# EAGLE design Schematic_Voltage_Monitoring_2 (EAGLE 9.6.2)
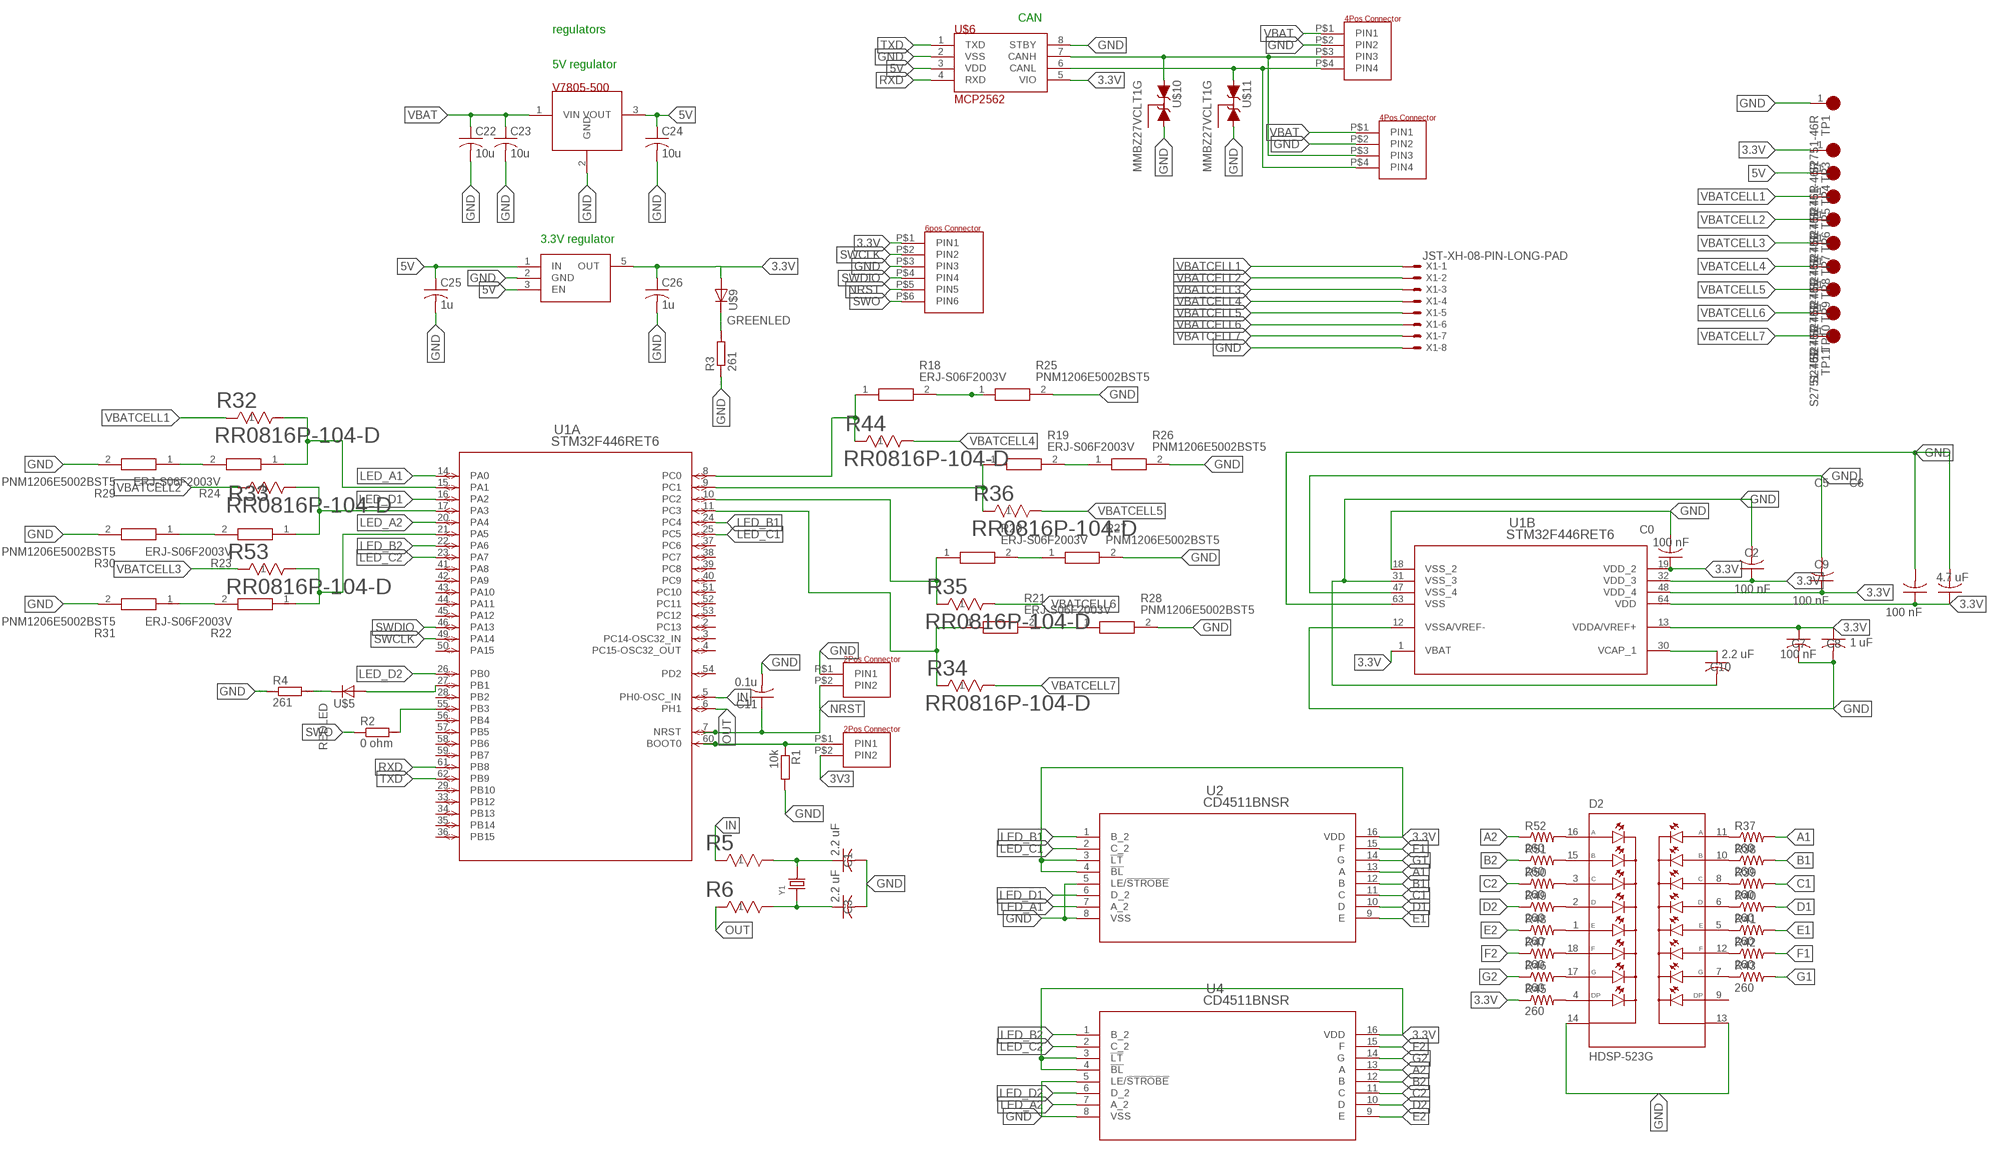
[diagram p0: schematic, sheet 1]

## Parts
C0  100 nF  C-USC0603  [C0603]
C1  2.2 uF  C-USC0603  [C0603]
C2  100 nF  C-USC0603  [C0603]
C3  2.2 uF  C-USC0603  [C0603]
C5  100 nF  C-USC0603  [C0603]
C6  4.7 uF  C-USC0603  [C0603]
C7  100 nF  C-USC0603  [C0603]
C8  1 uF  C-USC0603  [C0603]
C9  100 nF  C-USC0603  [C0603]
C10  2.2 uF  C-USC0603  [C0603]
C11  0.1u  C-USC1206K  [C1206K]
C22  10u  C-USC1206K  [C1206K]
C23  10u  C-USC1206K  [C1206K]
C24  10u  C-USC1206K  [C1206K]
C25  1u  C-USC1206K  [C1206K]
C26  1u  C-USC1206K  [C1206K]
D2  HDSP-523G  [LED_HDSP-523G]
R1  10k  R-EU_R0603  [R0603]
R2  0 ohm  R-EU_R0603  [R0603]
R3  261  RR0603  [R0603]
R4  261  RR0603  [R0603]
R5  RR0816P-104-D  [RES_0816_SUS]
R6  RR0816P-104-D  [RES_0816_SUS]
R18  ERJ-S06F2003V  [ERJS06_U06_(0805)]
R19  ERJ-S06F2003V  [ERJS06_U06_(0805)]
R20  ERJ-S06F2003V  [ERJS06_U06_(0805)]
R21  ERJ-S06F2003V  [ERJS06_U06_(0805)]
R22  ERJ-S06F2003V  [ERJS06_U06_(0805)]
R23  ERJ-S06F2003V  [ERJS06_U06_(0805)]
R24  ERJ-S06F2003V  [ERJS06_U06_(0805)]
R25  PNM1206E5002BST5  [RESC3216X71N]
R26  PNM1206E5002BST5  [RESC3216X71N]
R27  PNM1206E5002BST5  [RESC3216X71N]
R28  PNM1206E5002BST5  [RESC3216X71N]
R29  PNM1206E5002BST5  [RESC3216X71N]
R30  PNM1206E5002BST5  [RESC3216X71N]
R31  PNM1206E5002BST5  [RESC3216X71N]
R32  RR0816P-104-D  [RES_0816_SUS]
R33  RR0816P-104-D  [RES_0816_SUS]
R34  RR0816P-104-D  [RES_0816_SUS]
R35  RR0816P-104-D  [RES_0816_SUS]
R36  RR0816P-104-D  [RES_0816_SUS]
R37  260  R-US_R0603  [R0603]
R38  260  R-US_R0603  [R0603]
R39  260  R-US_R0603  [R0603]
R40  260  R-US_R0603  [R0603]
R41  260  R-US_R0603  [R0603]
R42  260  R-US_R0603  [R0603]
R43  260  R-US_R0603  [R0603]
R44  RR0816P-104-D  [RES_0816_SUS]
R45  260  R-US_R0603  [R0603]
R46  260  R-US_R0603  [R0603]
R47  260  R-US_R0603  [R0603]
R48  260  R-US_R0603  [R0603]
R49  260  R-US_R0603  [R0603]
R50  260  R-US_R0603  [R0603]
R51  260  R-US_R0603  [R0603]
R52  260  R-US_R0603  [R0603]
R53  RR0816P-104-D  [RES_0816_SUS]
TP1  S2751-46R  [HARWIN_S2751-46R]
TP3  S2751-46R  [HARWIN_S2751-46R]
TP4  S2751-46R  [HARWIN_S2751-46R]
TP5  S2751-46R  [HARWIN_S2751-46R]
TP6  S2751-46R  [HARWIN_S2751-46R]
TP7  S2751-46R  [HARWIN_S2751-46R]
TP8  S2751-46R  [HARWIN_S2751-46R]
TP9  S2751-46R  [HARWIN_S2751-46R]
TP10  S2751-46R  [HARWIN_S2751-46R]
TP11  S2751-46R  [HARWIN_S2751-46R]
U1  STM32F446RET6  [LQFP64-10X10MM]
U2  CD4511BNSR  [NS16]
U4  CD4511BNSR  [NS16]
U$1  4POS_CONNECTORMOLEX_MICROFIT3.0_RA_4PIN_2ROW  [MOLEX_MICROFIT3.0_0430450400]
U$2  4POS_CONNECTORMOLEX_MICROFIT3.0_RA_4PIN_2ROW  [MOLEX_MICROFIT3.0_0430450400]
U$3  6POS_CONNECTOR.1"PITCH_HEADERS  [6POS_HEADER_.1"]
U$4  2POS_CONNECTOR,.1"HEADER  [2POS_HEADER_.1"]
U$5  LED06033D_0603  [LEDC1608X35]
U$6  MCP2562  [SOIC8]
U$7  2POS_CONNECTOR,.1"HEADER  [2POS_HEADER_.1"]
U$8  V7805-500  [SIP3]
U$9  LED06033D_0603  [LEDC1608X35]
U$10  MMBZ27VCLT1G  [SOT23]
U$11  MMBZ27VCLT1G  [SOT23]
U$23  TLV70233DBVR  [SOT-23-5]
X1  JST-XH-08-PIN-LONG-PAD  [JST-XH-08-PACKAGE-LONG-PAD]
Y1  DIP-CRYSTAL-16MHZ-18PF-30PPM-40R(HC49US)  [HC49US]

## Nets
3.3V: C0.1 C2.1 C5.1 C6.1 C7.1 C8.1 C9.1 C26.1 R45.1 TP3.1(TP) U1.1(B:VBAT) U1.13(B:VDDA/VREF+) U1.19(B:VDD_2) U1.32(B:VDD_3) U1.48(B:VDD_4) U1.64(B:VDD) U2.3(!LT) U2.4(!BL) U2.16(VDD) U4.3(!LT) U4.4(!BL) U4.16(VDD) U$3.P$1(PIN1) U$6.5(VIO) U$9.A U$23.5(OUT)
3V3: U$7.P$2(PIN2)
5V: C24.1 C25.1 TP4.1(TP) U$6.3(VDD) U$8.3(VOUT) U$23.1(IN) U$23.3(EN)
A1 [New Class]: R37.2 U2.13(A)
A2 [New Class]: R52.1 U4.13(A)
B1 [New Class]: R38.2 U2.12(B)
B2 [New Class]: R51.1 U4.12(B)
C1 [New Class]: R39.2 U2.11(C)
C2 [New Class]: R50.1 U4.11(C)
CANH: U$1.P$3(PIN3) U$2.P$3(PIN3) U$6.7(CANH) U$10.1(A1)
CANL: U$1.P$4(PIN4) U$2.P$4(PIN4) U$6.6(CANL) U$11.1(A1)
D1 [New Class]: R40.2 U2.10(D)
D2 [New Class]: R49.1 U4.10(D)
E1 [New Class]: R41.2 U2.9(E)
E2 [New Class]: R48.1 U4.9(E)
F1 [New Class]: R42.2 U2.15(F)
F2 [New Class]: R47.1 U4.15(F)
G1 [New Class]: R43.2 U2.14(G)
G2 [New Class]: R46.1 U4.14(G)
GND: C0.2 C1.2 C2.2 C3.2 C5.2 C6.2 C7.2 C8.2 C9.2 C10.2 C11.2 C22.2 C23.2 C24.2 C25.2 C26.2 D2.13(COM2) D2.14(COM1) R1.2 R3.1 R4.1 R25.2 R26.2 R27.2 R28.2 R29.2 R30.2 R31.2 TP1.1(TP) U1.12(B:VSSA/VREF-) U1.18(B:VSS_2) U1.31(B:VSS_3) U1.47(B:VSS_4) U1.63(B:VSS) U2.5(LE/!STROBE) U2.8(VSS) U4.5(LE/!STROBE) U4.8(VSS) U$1.P$2(PIN2) U$2.P$2(PIN2) U$3.P$3(PIN3) U$4.P$1(PIN1) U$6.2(VSS) U$6.8(STBY) U$8.2(GND) U$10.2(A2) U$11.2(A2) U$23.2(GND) X1.8
GREENLED: R3.2 U$9.C
IN: R5.1 U1.5(A:PH0-OSC_IN)
LED_A1: U1.14(A:PA0) U2.7(A_2)
LED_A2: U1.20(A:PA4) U4.7(A_2)
LED_B1: U1.24(A:PC4) U2.1(B_2)
LED_B2: U1.22(A:PA6) U4.1(B_2)
LED_C1: U1.25(A:PC5) U2.2(C_2)
LED_C2: U1.23(A:PA7) U4.2(C_2)
LED_D1: U1.16(A:PA2) U2.6(D_2)
LED_D2: U1.26(A:PB0) U4.6(D_2)
N$1: C10.1 U1.30(B:VCAP_1)
N$2: R1.1 U1.60(A:BOOT0) U$7.P$1(PIN1)
N$3: R2.2 U1.55(A:PB3)
N$4: R19.1 R36.1 U1.9(A:PC1)
N$5: U1.27(A:PB1) U$5.A
N$6: C1.1 R5.2 Y1.2
N$7: C3.1 R6.2 Y1.1
N$14 [New Class]: D2.11(A2) R37.1
N$16 [New Class]: D2.10(B2) R38.1
N$17 [New Class]: D2.8(C2) R39.1
N$18 [New Class]: D2.6(D2) R40.1
N$19 [New Class]: D2.5(E2) R41.1
N$20 [New Class]: D2.12(F2) R42.1
N$21 [New Class]: D2.7(G2) R43.1
N$23 [New Class]: D2.4(DP1) R45.2
N$24 [New Class]: D2.17(G1) R46.2
N$25 [New Class]: D2.18(F1) R47.2
N$26 [New Class]: D2.1(E1) R48.2
N$27 [New Class]: D2.2(D1) R49.2
N$28 [New Class]: D2.3(C1) R50.2
N$29 [New Class]: D2.15(B1) R51.2
N$30 [New Class]: D2.16(A1) R52.2
N$34: R18.1 R44.1 U1.8(A:PC0)
N$36: R20.1 R35.1 U1.10(A:PC2)
N$37: R21.1 R34.1 U1.11(A:PC3)
N$38: R24.1 R32.2 U1.15(A:PA1)
N$39: R22.1 R53.2 U1.21(A:PA5)
N$40: R18.2 R25.1
N$41: R23.1 R33.2 U1.17(A:PA3)
N$42: R19.2 R26.1
N$43: R20.2 R27.1
N$44: R21.2 R28.1
N$45: R24.2 R29.1
N$46: R23.2 R30.1
N$47: R22.2 R31.1
NRST: C11.1 U1.7(A:NRST) U$3.P$5(PIN5) U$4.P$2(PIN2)
OUT: R6.1 U1.6(A:PH1)
REDLED: R4.2 U$5.C
RXD: U1.61(A:PB8) U$6.4(RXD)
SWCLK: U1.49(A:PA14) U$3.P$2(PIN2)
SWDIO: U1.46(A:PA13) U$3.P$4(PIN4)
SWO: R2.1 U$3.P$6(PIN6)
TXD: U1.62(A:PB9) U$6.1(TXD)
VBAT: C22.1 C23.1 U$1.P$1(PIN1) U$2.P$1(PIN1) U$8.1(VIN)
VBATCELL1: R32.1 TP5.1(TP) X1.1
VBATCELL2: R33.1 TP6.1(TP) X1.2
VBATCELL3: R53.1 TP7.1(TP) X1.3
VBATCELL4: R44.2 TP8.1(TP) X1.4
VBATCELL5: R36.2 TP9.1(TP) X1.5
VBATCELL6: R35.2 TP10.1(TP) X1.6
VBATCELL7: R34.2 TP11.1(TP) X1.7
Unconnected: D2.9(DP2) U1.2(A:PC13) U1.3(A:PC14-OSC32_IN) U1.4(A:PC15-OSC32_OUT) U1.28(A:PB2) U1.29(A:PB10) U1.33(A:PB12) U1.34(A:PB13) U1.35(A:PB14) U1.36(A:PB15) U1.37(A:PC6) U1.38(A:PC7) U1.39(A:PC8) U1.40(A:PC9) U1.41(A:PA8) U1.42(A:PA9) U1.43(A:PA10) U1.44(A:PA11) U1.45(A:PA12) U1.50(A:PA15) U1.51(A:PC10) U1.52(A:PC11) U1.53(A:PC12) U1.54(A:PD2) U1.56(A:PB4) U1.57(A:PB5) U1.58(A:PB6) U1.59(A:PB7) U$10.3(C) U$11.3(C)

## Notes on the sheet
- CAN
- regulators
- 5V regulator
- 3.3V regulator

## Library data of the parts
C0 C1-C3 C5-C11 C22-C26 = rcl:C-US: CAPACITOR, American symbol; SPICEPREFIX: C
D2 = HDSP-523G:HDSP-523G: Display Modules - LED Character and Numeric Green 7-Segment 2 Character Common Cathode 2V 10mA 0.732in H x 0.984in W x 0.315in D (18.60mm x 25.00mm x 8.00mm) 18-DIP (0.600", 15.24mm) Check availability <https://pricing.snapeda.com/parts/HDSP-523G/Broadcom%20Limited/view-part?ref=eda>; AVAILABILITY: In Stock; DESCRIPTION: Display Modules - LED Character and Numeric Green 7-Segment 2 Character Common Cathode 2V 10mA 0.732 H x 0.984 W x 0.315 D (18.60mm x 25.00mm x 8.00mm) 18-DIP (0.600, 15.24mm); MF: Broadcom Limited; MP: HDSP-523G; PACKAGE: None; PRICE: None; PURCHASE-URL: https://pricing.snapeda.com/search/part/HDSP-523G/?ref=eda
R1 R2 = rcl:R-EU_: RESISTOR, European symbol; SPICEPREFIX: R
R3 R4 = eagle-ltspice:R: RESISTOR, European symbol; SPICEMODEL: NONE; SPICEPREFIX: R
R5 R6 R32-R36 R44 R53 = RES_0816_SUS-L:RR0816P-104-D; COPYRIGHT: Copyright (C) 2022 Ultra Librarian. All rights reserved.; DIGI-KEY_PART_NUMBER_1: RR08P100KDCT-ND; DIGI-KEY_PART_NUMBER_2: RR08P100KDDKR-ND; DIGI-KEY_PART_NUMBER_3: RR08P100KDTR-ND; DIGI-KEY_PART_NUMBER_4: RR08P100KDTR-NDL; MANUFACTURER_PART_NUMBER: RR0816P-104-D; MFR_NAME: Susumu
R18-R24 = ERJ-S06F2003V:ERJ-S06F2003V: Anti-Sulfurated Thick Film Chip Resistor, 0805, 0.125W Source: Datasheet <https://industrial.panasonic.com/cdbs/www-data/pdf/RDP0000/AOA0000C334.pdf>; DESCRIPTION: Anti-Sulfurated Thick Film Chip Resistor, 0805, 0.125W; HEIGHT: 0.7mm; MANUFACTURER_NAME: Panasonic; MANUFACTURER_PART_NUMBER: ERJ-S06F2003V; MOUSER_PART_NUMBER: 667-ERJ-S06F2003V; MOUSER_PRICE-STOCK: https://www.mouser.co.uk/ProductDetail/Panasonic/ERJ-S06F2003V?qs=Zyl8A9hlmJrPJBwR8QJJlg%3D%3D
R25-R31 = PNM1206E5002BST5:PNM1206E5002BST5: RESISTOR, 1206 50K Ohms +/- 0.1 % 400mW Source: Datasheet <https://www.mouser.com/datasheet/2/427/pnm-247439.pdf>; DESCRIPTION: RESISTOR, 1206 50K Ohms +/- 0.1 % 400mW; HEIGHT: mm; MANUFACTURER_NAME: Vishay; MANUFACTURER_PART_NUMBER: PNM1206E5002BST5; MOUSER_PART_NUMBER: 71-PNM1206E5002BST5
R37-R43 R45-R52 = rcl:R-US_: RESISTOR, American symbol; SPICEPREFIX: R
TP1 TP3-TP11 = CMR:S2751-46R: EZ-Test Point, SMT, tin, Tape and Reeled Check prices <https://pricing.snapeda.com/parts/S2751-46R/Harwin%20Inc./view-part?ref=eda>; AVAILABILITY: In Stock; DESCRIPTION: Natural PC Test Point Brass, Tin Plating Surface Mount Mounting Type; MF: Harwin Inc.; MP: S2751-46R; PACKAGE: None; PRICE: None; PURCHASE-URL: https://pricing.snapeda.com/search/part/S2751-46R/?ref=eda
U1 = CMR:STM32F446RET6; COPYRIGHT: Copyright (C) 2022 Ultra Librarian. All rights reserved.; MANUFACTURER_PART_NUMBER: STM32F446RET6; MFR_NAME: STMicroelectronics
U2 U4 = CMR:CD4511BNSR; COPYRIGHT: Copyright (C) 2022 Ultra Librarian. All rights reserved.; MANUFACTURER_PART_NUMBER: CD4511BNSR; MFR_NAME: Texas Instruments
U$1 U$2 = CMR:4POS_CONNECTOR: 4 position connector could be header or connector
U$3 = CMR:6POS_CONNECTOR: An arbitray 6 position connector. packages should denote pin 1 using a square pad
U$4 U$7 = CMR:2POS_CONNECTOR: Harwin 2mm 2 POS Connector Male - https://www.digikey.com/product-detail/en/harwin-inc/M80-8520242/952-1769-ND/3727738 Female - https://www.digikey.com/product-detail/en/harwin-inc/M80-8980205/952-1182-ND/2264171
U$5 U$9 = CMR:LED0603: LED size 0603 for debugging pic
U$6 = CMR:MCP2562: CAN Transciever with built in level shifter
U$8 = CMR:V7805-500: Switching regulator (24V to 5V); max output current: 500mA; SPICEPREFIX: U
U$10 U$11 = CMR:MMBZ27VCLT1G: MMBZ27VCLT1G TVS Diode for protecting against ESD events link: https://www.digikey.com/product-detail/en/on-semiconductor/MMBZ27VCLT1G/MMBZ27VCLT1GOSCT-ND/964555
U$23 = CMR:TLV70233DBVR: TLV702 300-mA, Low-IQ, Low-Dropout Regulator
X1 = Rembrandt Electronics - JST XH Connectors v1-0:JST-XH-08-PIN: JST XH Connector 2 Pin Wire to board connector. Pitch: 2,54 mm, (0.100") Number of pins: 8 Created by Rembrandt Electronics www.rembrandtelectronics.com
Y1 = DIP-CRYSTAL-16MHZ-18PF-30PPM-40R_HC49US_:DIP-CRYSTAL-16MHZ-18PF-30PPM-40R(HC49US): 306010014 Check availability <https://pricing.snapeda.com/parts/HC49US16000MHZ/Kyocera/view-part?ref=eda>; AVAILABILITY: Not in stock; MF: Kyocera; MP: HC49US16000MHZ; PACKAGE: None; PRICE: None

## Board
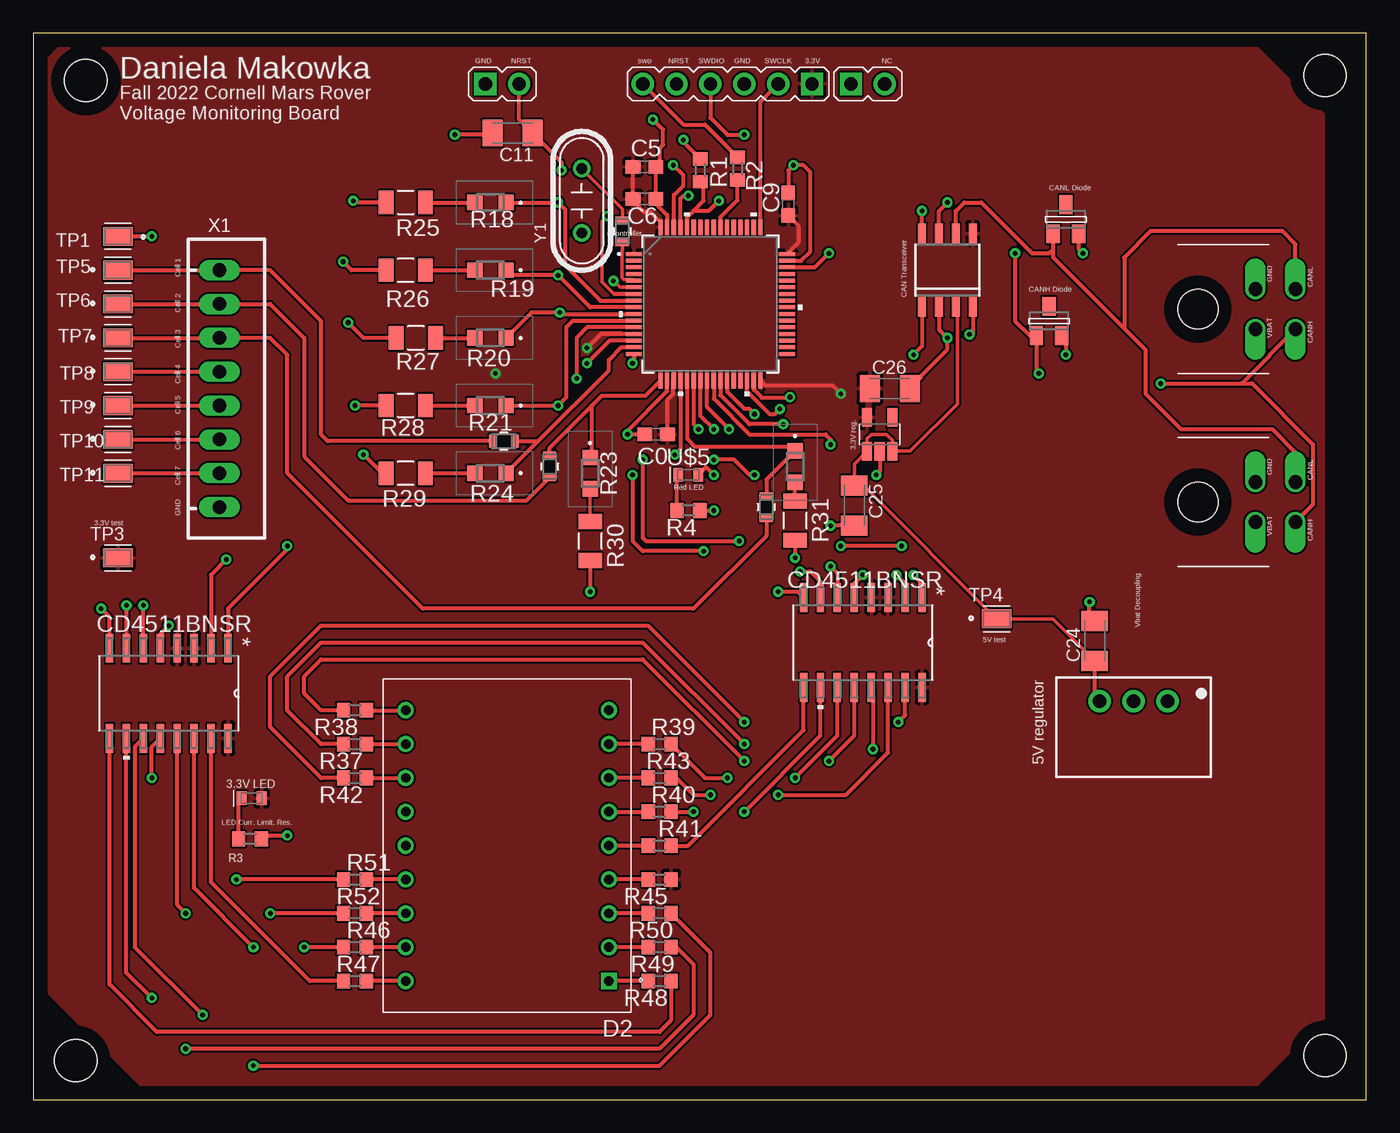
[diagram p1: board, top side]
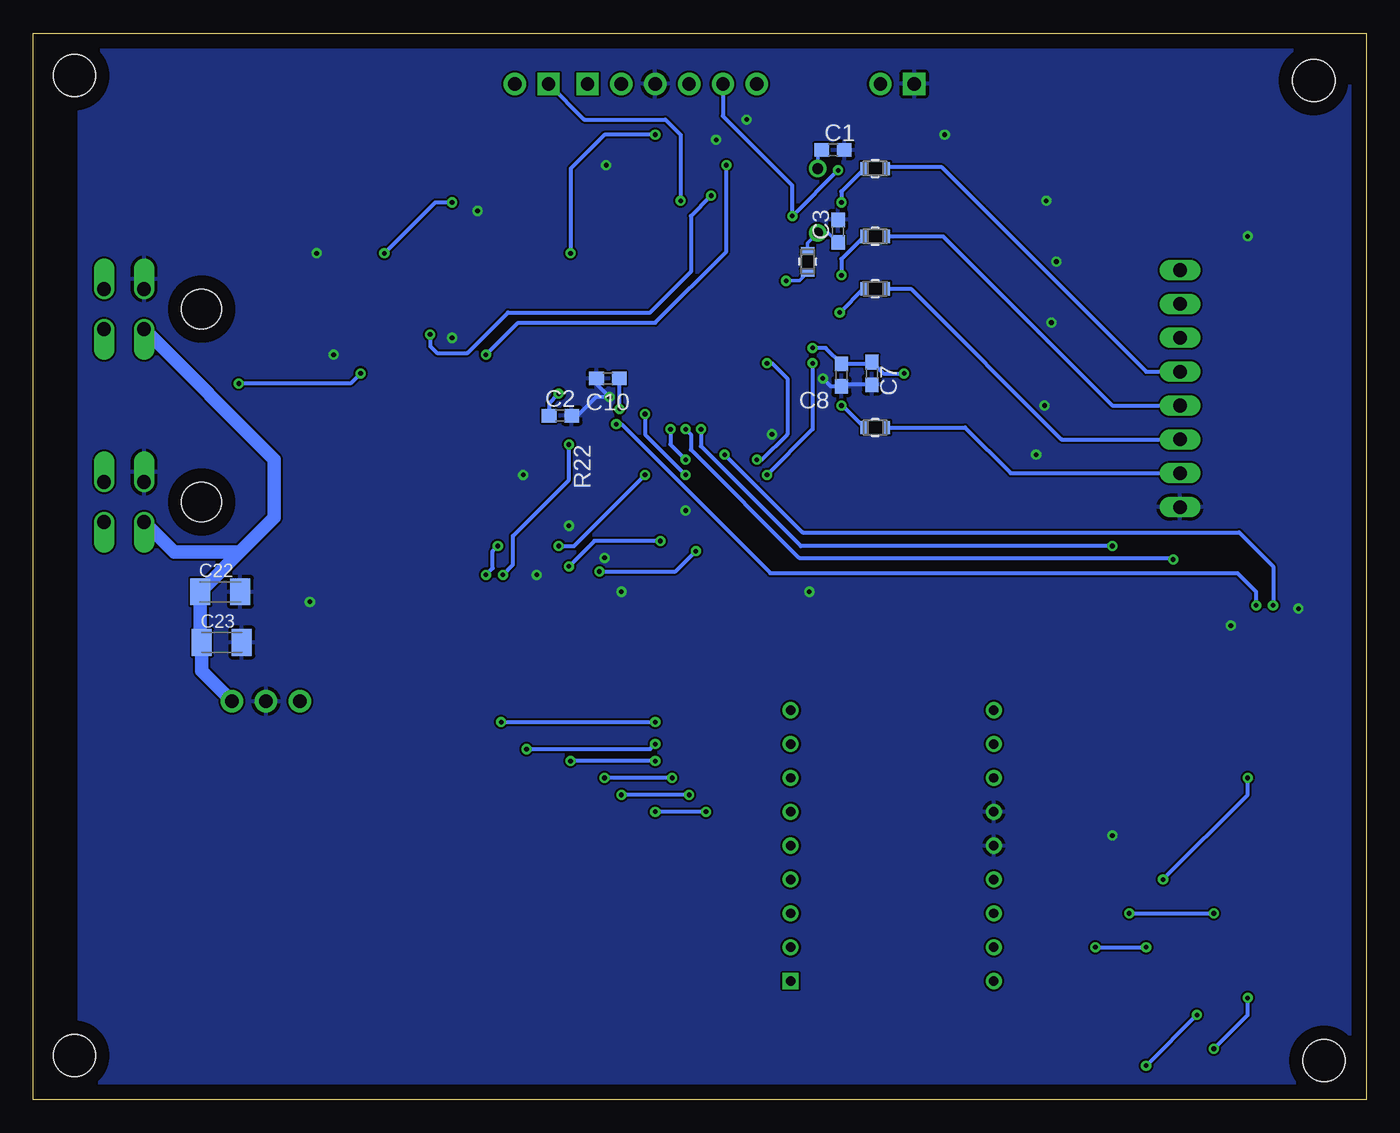
[diagram p2: board, bottom side, seen from below]

Size 100 x 80 mm. Coordinates in mm from the lower left corner, seen from the top.
Outline: 0,0 100,0 100,80 0,80 0,0
Copper layers (1*16): Top 0.035mm / dielectric 1.5mm / Bottom 0.035mm
Design rules "default": minimum track width 6mil, minimum drill 0.35mm, track to track 6mil, track to pad 6mil, pad to pad 6mil, via to via 6mil, smd to smd 6mil, copper to edge 40mil, drill to drill 6mil, minimum pad ring 10mil, minimum via ring 8mil, stop-mask expansion 4mil, vias tented up to drill 0mil, thermal gap 10mil
Holes 3.17 mm at 3.94,76.45 96.9,76.83 3.17,2.92 96.9,3.3

### Footprints (pad centres in the part's own frame; a part is rotated, then mirrored left to right if it is on the bottom)
C0603 = smd 1.1 x 1: 1 -0.85,0; 2 0.85,0
C1206K = smd 1.5 x 2: 1 -1.5,0; 2 1.5,0
LED_HDSP-523G = drill 0.7 square: 1 -7.62,10.16 | drill 0.7: 2 -7.62,7.62; 3 -7.62,5.08; 4 -7.62,2.54; 5 -7.62,0; 6 -7.62,-2.54; 7 -7.62,-5.08; 8 -7.62,-7.62; 9 -7.62,-10.16; 10 7.62,-10.16; 11 7.62,-7.62; 12 7.62,-5.08; 13 7.62,-2.54; 14 7.62,0; 15 7.62,2.54; 16 7.62,5.08; 17 7.62,7.62; 18 7.62,10.16
R0603 = smd 1 x 1.1: 1 -0.85,0; 2 0.85,0
RES_0816_SUS = smd 0.553 x 1: 1 -0.827,0; 2 0.827,0
ERJS06_U06_(0805) = smd 1.15 x 1.15: 1 -1.175,0; 2 1.175,0
RESC3216X71N = smd 1.118 x 1.753: 1 -1.473,0; 2 1.473,0
HARWIN_S2751-46R = smd 2.2 x 1.4: 1 0,0
LQFP64-10X10MM = smd 1.194 x 0.305: 1 -5.75,3.75; 2 -5.75,3.25; 3 -5.75,2.75; 4 -5.75,2.25; 5 -5.75,1.75; 6 -5.75,1.25; 7 -5.75,0.75; 8 -5.75,0.25; 9 -5.75,-0.25; 10 -5.75,-0.75; 11 -5.75,-1.25; 12 -5.75,-1.75; 13 -5.75,-2.25; 14 -5.75,-2.75; 15 -5.75,-3.25; 16 -5.75,-3.75; 33 5.75,-3.75; 34 5.75,-3.25; 35 5.75,-2.75; 36 5.75,-2.25; 37 5.75,-1.75; 38 5.75,-1.25; 39 5.75,-0.75; 40 5.75,-0.25; 41 5.75,0.25; 42 5.75,0.75; 43 5.75,1.25; 44 5.75,1.75; 45 5.75,2.25; 46 5.75,2.75; 47 5.75,3.25; 48 5.75,3.75 | smd 0.305 x 1.194: 17 -3.75,-5.75; 18 -3.25,-5.75; 19 -2.75,-5.75; 20 -2.25,-5.75; 21 -1.75,-5.75; 22 -1.25,-5.75; 23 -0.75,-5.75; 24 -0.25,-5.75; 25 0.25,-5.75; 26 0.75,-5.75; 27 1.25,-5.75; 28 1.75,-5.75; 29 2.25,-5.75; 30 2.75,-5.75; 31 3.25,-5.75; 32 3.75,-5.75; 49 3.75,5.75; 50 3.25,5.75; 51 2.75,5.75; 52 2.25,5.75; 53 1.75,5.75; 54 1.25,5.75; 55 0.75,5.75; 56 0.25,5.75; 57 -0.25,5.75; 58 -0.75,5.75; 59 -1.25,5.75; 60 -1.75,5.75; 61 -2.25,5.75; 62 -2.75,5.75; 63 -3.25,5.75; 64 -3.75,5.75
NS16 = smd 2.159 x 0.559: 1 -3.378,4.445; 2 -3.378,3.175; 3 -3.378,1.905; 4 -3.378,0.635; 5 -3.378,-0.635; 6 -3.378,-1.905; 7 -3.378,-3.175; 8 -3.378,-4.445; 9 3.378,-4.445; 10 3.378,-3.175; 11 3.378,-1.905; 12 3.378,-0.635; 13 3.378,0.635; 14 3.378,1.905; 15 3.378,3.175; 16 3.378,4.445
MOLEX_MICROFIT3.0_0430450400 = drill 1.02 offset: P$1 1.5,4.32; P$2 -1.5,4.32; P$3 1.5,7.32; P$4 -1.5,7.32 | hole 3: 0,0
6POS_HEADER_.1" = drill 0.991 pad 1.676 square: P$1 0,0 | drill 0.991 pad 1.676: P$2 2.54,0; P$3 5.08,0; P$4 7.62,0; P$5 10.16,0; P$6 12.7,0
2POS_HEADER_.1" = drill 0.991 pad 1.676 square: P$1 0,0 | drill 0.991 pad 1.676: P$2 2.54,0
LEDC1608X35 = smd 0.724 x 1.024: A 0.75,0; C -0.75,0
SOIC8 = smd 0.6 x 1.5: 1 -1.905,-2.75; 2 -0.635,-2.75; 3 0.635,-2.75; 4 1.905,-2.75; 5 1.905,2.75; 6 0.635,2.75; 7 -0.635,2.75; 8 -1.905,2.75
SIP3 = drill 1 pad 1.676: 1 -2.54,-1.943; 2 0,-1.943; 3 2.54,-1.943
SOT23 = smd 1 x 1.4: 1 -0.95,-1.1; 2 0.95,-1.1; 3 0,1.1
SOT-23-5 = smd 0.762 x 1.397: 1 -0.953,-1.27; 2 0,-1.27; 3 0.953,-1.27; 4 0.953,1.27; 5 -0.953,1.27
JST-XH-08-PACKAGE-LONG-PAD = drill 1.016 long: 1 -8.89,0; 2 -6.35,0; 3 -3.81,0; 4 -1.27,0; 5 1.27,0; 6 3.81,0; 7 6.35,0; 8 8.89,0
HC49US = drill 0.813: 1 -2.413,0; 2 2.413,0

### Placement (x,y rotation side)
C0  46.74,49.91 180 top
C1  40.01,71.25 0 bottom
C2  60.45,51.31 0 bottom
C3  39.62,65.15 90 bottom
C5  45.85,69.98 0 top
C6  45.85,67.56 0 top
C7  37.08,54.48 270 bottom
C8  39.37,54.36 270 bottom
C9  56.64,67.18 90 top
C10  56.9,54.1 180 bottom
C11  35.94,72.52 180 top
C22  85.98,38.1 0 bottom
C23  85.85,34.29 0 bottom
C24  79.63,34.42 90 top
C25  61.59,44.58 270 top
C26  64.26,53.34 0 top
D2  35.56,19.05 180 top
R1  50.04,69.72 90 top
R2  52.83,69.85 270 top
R3  16.26,19.56 180 top
R4  49.15,44.2 180 top
R5  44.2,65.15 90 top
R6  41.91,62.87 90 bottom
R18  34.29,67.31 180 top
R19  34.29,62.23 180 top
R20  34.29,57.15 180 top
R21  34.29,52.07 180 top
R22  57.15,47.5 270 top
R23  41.78,46.99 270 top
R24  34.29,46.99 180 top
R25  27.94,67.31 180 top
R26  27.94,62.23 180 top
R27  28.7,57.15 180 top
R28  27.94,52.07 180 top
R29  27.94,46.99 180 top
R30  41.78,41.91 270 top
R31  57.15,43.43 270 top
R32  35.31,49.4 0 top
R33  38.73,47.5 90 top
R34  36.83,50.42 0 bottom
R35  36.83,60.83 0 bottom
R36  36.83,64.77 0 bottom
R37  24.13,26.67 180 top
R38  24.13,29.21 180 top
R39  46.99,26.67 0 top
R40  46.99,21.59 0 top
R41  46.99,19.05 0 top
R42  24.13,24.13 180 top
R43  46.99,24.13 0 top
R44  36.83,69.85 0 bottom
R45  46.99,16.51 180 top
R46  24.13,11.43 0 top
R47  24.13,8.89 0 top
R48  46.99,8.89 180 top
R49  46.99,11.43 180 top
R50  46.99,13.97 180 top
R51  24.13,16.51 0 top
R52  24.13,13.97 0 top
R53  54.99,44.45 90 top
TP1  6.35,64.77 180 top
TP3  6.35,40.64 0 top
TP4  72.26,36.07 0 top
TP5  6.35,62.23 0 top
TP6  6.35,59.69 0 top
TP7  6.35,57.15 0 top
TP8  6.35,54.61 0 top
TP9  6.35,52.07 0 top
TP10  6.35,49.53 0 top
TP11  6.35,46.99 0 top
U1  50.8,59.69 0 top
U2  62.23,34.29 270 top
U4  10.16,30.48 270 top
U$1  87.38,59.31 270 top
U$2  87.38,44.83 270 top
U$3  58.42,76.2 180 top
U$4  33.91,76.2 0 top
U$5  49.15,46.86 0 top
U$6  68.58,62.23 0 top
U$7  61.34,76.2 0 top
U$8  82.55,27.94 180 top
U$9  16.38,22.61 0 top
U$10  76.2,58.42 0 top
U$11  77.47,66.04 0 top
U$23  63.5,49.91 0 top
X1  13.97,53.34 270 top
Y1  41.15,67.44 90 top

### Tracks (layer width: path | path; a pad name or v marks a point on that pad's centre or on a via)
3.3V  (via drill 0.35)
  Top 0.305: U$6.5 70.66,64.98 | TP3.1 7.37,40.64 | U1.13 42.58,57.44 v41.53,56.39 | C0.1 47.59,52.53 48.01,52.95 48.01,53.9 U1.19 | U1.32 54.93,53.56 59.98,53.56 v60.58,52.96 | C9.1 57.4,65.57 57.4,64.29 U1.48 | U1.64 47.05,65.82 46.29,66.58 45.81,66.58 45,67.4 C6.1 C5.1
  Bottom 0.305: v41.53,56.39 40.55,56.39 C8.1 37.21,55.21 C7.1 36.23,54.48 v34.67,54.48 | v60.58,52.96 61.3,52.24 C2.1
  pour Top: 1.91,78.87 91.82,78.87 96.77,73.91 96.77,6.1 91.82,1.14 8,1.14 1.14,8 1.14,78.11
5V
  Top 0.254: C24.1 76.48,36.07 TP4.1 62.31,46.03 61.65,46.03 | C25.1 61.59,47.69 U$23.1 62.55,49.59 62.87,49.91 64.01,49.91 64.45,49.47 U$23.3 65.79,48.64 69.34,52.2 69.34,59.35 U$6.3
  Top 0.305: 61.65,46.03 C25.1 | U$8.3 79.63,30.26 C24.1
A1  (via drill 0.35)
  Top 0.305: R37.2 21.59,26.67 19.05,29.21 19.05,31.75 21.59,34.29 45.72,34.29 v53.34,26.67 | U2.13 62.99,30.79 v62.99,26.29
  Bottom 0.305: v62.99,26.29 53.72,26.29 v53.34,26.67
A2  (via drill 0.35)
  Top 0.305: R52.1 v17.78,13.97 | v11.43,13.97 10.79,14.61 U4.13
  Bottom 0.305: v17.78,13.97 v11.43,13.97
B1  (via drill 0.35)
  Top 0.305: R38.2 21.59,29.21 20.32,30.48 20.32,31.75 21.59,33.02 45.72,33.02 v53.34,25.4 | v59.69,25.4 61.59,27.3 U2.12
  Bottom 0.305: v53.34,25.4 v59.69,25.4
B2  (via drill 0.35)
  Top 0.305: R51.1 v15.24,16.51 | v8.89,24.13 8.89,26.47 U4.12
  Bottom 0.305: v15.24,16.51 8.89,22.86 v8.89,24.13
C1  (via drill 0.35)
  Top 0.305: R39.2 50.38,24.13 v52.07,24.13 | v57.15,24.13 60.33,27.3 U2.11
  Bottom 0.305: v52.07,24.13 v57.15,24.13
C2  (via drill 0.35)
  Top 0.305: U4.11 7.62,26.47 7.62,11.43 v12.7,6.35 | v16.51,2.54 46.99,2.54 50.8,6.35 50.8,11.01 R50.1
  Bottom 0.305: v12.7,6.35 v16.51,2.54
CANH  (via drill 0.35)
  Top 0.305: U$6.7 67.94,66.67 v68.58,67.31 | v73.66,63.5 73.66,58.42 74.76,57.32 U$10.1 75.25,54.67 v75.44,54.48 | U$1.P$3 92.77,55.88 92.77,55.84 90.65,53.72 | v84.58,53.72 90.65,53.72 | 90.65,53.72 91.44,53.72 96.01,49.15 96.01,44.65 U$2.P$3
  Bottom 0.305: v68.58,67.31 69.85,67.31 v73.66,63.5 | v75.44,54.48 76.2,53.72 v84.58,53.72
CANL
  Top 0.305: U$6.6 69.22,66.67 69.85,67.31 71.12,67.31 74.93,63.5 76.2,63.5 76.52,63.82 | 76.52,63.82 U$11.1 | 76.52,63.82 76.52,63.18 81.85,57.85 | 81.85,57.85 83.44,56.26 83.44,52.96 86.11,50.29 92.96,50.29 94.7,48.56 U$2.P$4 | U$1.P$4 94.7,64.18 93.73,65.15 83.82,65.15 81.85,63.18 81.85,57.85
D1  (via drill 0.35)
  Top 0.305: R40.2 v49.53,21.59 | v53.34,21.59 59.05,27.3 U2.10
  Bottom 0.305: v49.53,21.59 v53.34,21.59
D2  (via drill 0.35)
  Top 0.305: R49.1 48.26,11.43 49.53,10.16 49.53,6.35 46.99,3.81 v11.43,3.81 | v8.89,7.62 6.99,9.53 U4.10
  Bottom 0.305: v11.43,3.81 8.89,6.35 v8.89,7.62
E1
  Top 0.305: R41.2 49.11,19.05 57.78,27.73 U2.9
E2
  Top 0.305: R48.1 47.84,5.93 46.99,5.08 9.27,5.08 5.71,8.64 U4.9
F1  (via drill 0.35)
  Top 0.305: R42.2 21.59,24.13 17.78,27.94 17.78,31.75 21.59,35.56 46.1,35.56 v53.34,28.32 | v64.9,28.32 65.41,28.83 U2.15
  Bottom 0.305: v64.9,28.32 v53.34,28.32
F2
  Top 0.305: R47.1 20.74,8.89 13.34,16.3 U4.15
G1  (via drill 0.35)
  Top 0.305: R43.2 48.26,24.13 49.53,22.86 v50.8,22.86 | v55.88,22.86 60.96,22.86 64.14,26.04 U2.14
  Bottom 0.305: v50.8,22.86 v55.88,22.86
G2  (via drill 0.35)
  Top 0.305: R46.1 v20.32,11.43 | v16.51,11.43 12.06,15.88 U4.14
  Bottom 0.305: v20.32,11.43 v16.51,11.43
GND  (via drill 0.35)
  Top 0.305: U$10.2 77.47,57 v77.47,55.88 | R31.2 v57.15,40.64 | R29.2 26.16,46.99 v24.77,48.39 | R28.2 v24.13,52.07 | U$6.2 67.94,57.78 v68.58,57.15 68.58,56.27 66.6,54.29 66.6,54.18 C26.2 | TP1.1 v8.89,64.77 | U1.63 47.55,66.37 46.7,67.22 C6.2 C5.2 46.97,70.25 46.97,71.36 | U$11.2 78.42,63.82 v78.74,63.5 | U2.8 57.35,38.1 v55.88,38.1 | U4.8 5.71,36.2 v5.08,36.83 | U4.5 9.53,34.92 v10.16,35.56 | U2.5 61.59,38.73 v62.23,39.37 | U1.18 47.55,53.14 44.58,50.16 v44.58,49.91 C0.2 | C9.2 56.64,69.72 v57.02,70.1 57.78,70.1 58.29,69.6 58.29,63.63 57.61,62.94 U1.47 | R30.2 v41.78,38.1 | v56.77,52.7 56.72,52.66 54.65,52.66 54.05,53.26 U1.31 | U$6.8 v66.67,66.67 | U1.12 41.56,57.94 40.77,57.15 v40.77,54.1 | C25.2 59.84,43.08 v59.82,43.05 | U$23.2 63.5,47.12 v63.25,46.86 | C24.2 79.25,36.3 v79.25,37.34 | 46.97,71.36 46.99,71.33 | 46.97,71.36 47.24,71.63 47.24,72.77 v46.48,73.53 | R4.1 v51.05,44.2 | R3.1 17.36,19.81 v19.05,19.81 | v48.77,72.01 48.77,71.84 R1.2 | C11.2 34.31,72.39 v31.62,72.39 | R25.2 24.13,67.31 v24,67.44 | R26.2 23.88,62.23 v23.24,62.87 | R27.2 24.77,57.15 v23.62,58.29
  Bottom 0.305: C2.2 59.6,51.05 59.44,51.05 57.78,52.7 v56.77,52.7 57.75,53.68 C10.2 | C7.2 39.24,53.63 C8.2 40.17,53.51 v40.77,54.1
  pour Bottom: 96.52,78.74 6.35,78.74 1.27,78.74 1.27,1.27 96.52,1.27
GREENLED
  Top 0.305: R3.2 15.41,22.38 U$9.C
IN
  Top 0.254: R5.1 44.2,63.73 44.17,63.71 44.17,61.67 44.34,61.51 44.98,61.51 U1.5
LED_A1  (via drill 0.35)
  Top 0.305: U1.14 43.22,56.94 v41.53,55.24 | v44.96,46.86 44.96,41.91 45.72,41.15 v50.29,41.15 | v57.53,39.62 58.29,39.62 59.05,38.86 U2.7
  Bottom 0.305: v44.96,46.86 41.53,50.29 v41.53,55.24 | v50.29,41.15 51.82,39.62 v57.53,39.62
LED_A2  (via drill 0.35)
  Top 0.305: U1.20 48.55,48.8 v48.13,48.39 | v6.99,37.08 U4.7
  Bottom 0.305: v48.13,48.39 42.29,42.55 9.53,42.55 6.99,40.01 v6.99,37.08
LED_B1  (via drill 0.35)
  Top 0.305: U2.1 66.67,38.73 v66.04,39.37 | v65.15,41.53 v60.58,41.53 | v54.1,46.86 53.72,46.86 52.58,48.01 v51.05,48.01 | v52.2,50.29 50.55,51.94 U1.24
  Bottom 0.305: v66.04,39.37 65.53,39.88 65.53,41.15 v65.15,41.53 | v60.58,41.53 59.44,41.53 v54.1,46.86 | v51.05,48.01 52.2,49.15 v52.2,50.29
LED_B2  (via drill 0.35)
  Top 0.305: v19.05,41.53 19.05,41.27 14.61,36.83 U4.1 | v49.91,50.29 49.55,50.65 U1.22
  Bottom 0.305: v19.05,41.53 42.42,41.53 49.91,49.02 v49.91,50.29
LED_C1  (via drill 0.35)
  Top 0.305: U2.2 65.41,38.73 v64.77,39.37 | U1.25 51.05,52.58 53.72,49.91 59.44,49.91 59.82,49.53 v59.82,49.15
  Bottom 0.305: v64.77,39.37 64.01,40.13 64.01,42.29 59.82,46.48 v59.82,49.15
LED_C2  (via drill 0.35)
  Top 0.305: v14.48,40.51 13.34,39.37 U4.2 | v51.05,50.29 50.05,51.3 U1.23
  Bottom 0.305: v14.48,40.51 14.61,40.64 42.55,40.64 50.67,48.77 50.67,49.91 v51.05,50.29
LED_D1  (via drill 0.35)
  Top 0.305: U1.16 45.05,55.34 v44.96,55.24 | v45.72,48.01 45.72,42.18 45.99,41.91 v52.96,41.91 | v59.82,40.01 60.33,39.5 U2.6
  Bottom 0.305: v44.96,55.24 44.58,55.24 43.43,54.1 43.43,49.91 45.34,48.01 v45.72,48.01 | v52.96,41.91 57.91,41.91 v59.82,40.01
LED_D2  (via drill 0.35)
  Top 0.305: U4.6 v8.26,37.08 | U1.26 51.55,52.84 53.72,50.67 v56.26,50.67
  Bottom 0.305: v8.26,37.08 8.26,38.1 9.65,39.5 44.7,39.5 55.88,50.67 v56.26,50.67
N$1  (via drill 0.35)
  Top 0.305: U1.30 53.55,53.11 55.23,51.44 55.63,51.44 v56.01,51.82
  Bottom 0.305: v56.01,51.82 56.01,53.72 56.05,53.76 C10.1
N$2  (via drill 0.35)
  Top 0.305: U1.60 49.05,66.19 49.53,66.67 | 49.53,66.67 50.29,67.44 50.29,68.62 R1.1 | v51.44,67.44 50.67,66.67 49.53,66.67
  Bottom 0.305: U$7.P$1 58.67,73.53 52.58,73.53 51.44,72.39 v51.44,67.44
N$3
  Top 0.305: U1.55 51.55,66.19 52.83,67.48 R2.2
N$4  (via drill 0.35)
  Top 0.305: R19.1 35.85,61.85 v39.37,61.85 41.78,59.44 U1.9
  Bottom 0.305: R36.1 39.37,63.06 v39.37,61.85
N$5  (via drill 0.35)
  Top 0.305: U1.27 52.05,53.11 53.34,51.82 53.72,51.82 v54.1,51.44 | v51.05,46.86 50.48,47.44 U$5.A
  Bottom 0.305: v54.1,51.44 54.1,49.91 v51.05,46.86
N$6
  Top 0.254: R5.2 44.2,66.8 Y1.2
  Bottom 0.254: C1.1 41.15,70.95 Y1.2
N$7
  Bottom 0.254: C3.1 40.35,65.02 Y1.1 41.91,64.26 R6.2
N$14
  Top 0.305: R37.1 D2.11
N$16
  Top 0.305: R38.1 D2.10
N$17
  Top 0.305: R39.1 D2.8
N$18
  Top 0.305: D2.6 R40.1
N$19
  Top 0.305: R41.1 D2.5
N$20
  Top 0.305: R42.1 D2.12
N$21
  Top 0.305: R43.1 D2.7
N$23
  Top 0.305: R45.2 D2.4
N$24
  Top 0.305: D2.17 R46.2
N$25
  Top 0.305: D2.18 R47.2
N$26
  Top 0.305: R48.2 D2.1
N$27
  Top 0.305: R49.2 D2.2
N$28
  Top 0.305: R50.2 D2.3
N$29
  Top 0.305: D2.15 R51.2
N$30
  Top 0.305: D2.16 R52.2
N$34  (via drill 0.35)
  Top 0.305: R18.1 v39.37,67.31 39.88,66.8 39.88,62.61 42.55,59.94 U1.8
  Bottom 0.305: R44.1 39.37,68.14 v39.37,67.31
N$36  (via drill 0.35)
  Top 0.305: R20.1 37.37,59.05 v39.5,59.05 39.61,58.94 U1.10
  Bottom 0.305: R35.1 37.72,60.83 v39.5,59.05
N$37  (via drill 0.35)
  Top 0.305: R21.1 v39.37,52.07 40.01,52.7 40.01,57.97 40.48,58.44 U1.11
  Bottom 0.305: v39.37,52.07 39.31,52.07 R34.1
N$38
  Top 0.305: R24.1 37.88,49.4 | 37.88,49.4 43.18,54.7 43.18,55.5 44.12,56.44 U1.15 | R32.2 37.88,49.4
N$39
  Top 0.305: U1.21 49.05,49.58 49.65,48.97 56.85,48.97 R22.1 54.99,46.51 R53.2
N$40
  Top 0.305: R25.1 R18.2
N$41
  Top 0.305: R33.2 38.73,48.9 41.91,52.07 | 41.91,52.07 42.64,52.8 45.91,52.8 U1.17 | R23.1 41.91,48.29 41.91,52.07
N$42
  Top 0.305: R26.1 R19.2
N$43
  Top 0.305: R27.1 R20.2
N$44
  Top 0.305: R28.1 R21.2
N$45
  Top 0.305: R29.1 R24.2
N$46
  Top 0.254: R23.2 R30.1
N$47
  Top 0.305: R31.1 R22.2
NRST  (via drill 0.35)
  Top 0.254: 43.57,60.44 42.67,61.34 42.67,65.91 v43.05,66.29
  Top 0.305: U1.7 43.57,60.44 | v39.62,69.72 39.62,70.33 C11.1 36.45,73.51 U$4.P$2
  Bottom 0.305: U$3.P$5 48.26,73.79 43.05,68.58 v43.05,66.29 v39.62,69.72
OUT  (via drill 0.35)
  Top 0.254: v43.52,61.43 44,60.94 U1.6
  Bottom 0.254: R6.1 42.52,61.43 v43.52,61.43
REDLED
  Top 0.305: R4.2 48.3,46.76 U$5.C
RXD  (via drill 0.35)
  Top 0.305: U$6.4 70.48,57.4 v70.23,57.4 | U1.61 48.55,67.6 48.77,67.82 v49.15,67.82
  Bottom 0.305: v70.23,57.4 70.23,56.52 69.72,56.01 67.44,56.01 64.39,59.05 53.72,59.05 50.67,62.1 50.67,66.29 v49.15,67.82
SWCLK
  Top 0.305: U1.49 54.55,74.87 U$3.P$2
SWDIO  (via drill 0.35)
  Top 0.305: U$3.P$4 50.8,73.66 52.07,72.39 v53.34,72.39 | v59.69,63.5 58.63,62.44 U1.46
  Bottom 0.305: v53.34,72.39 57.15,72.39 59.69,69.85 v59.69,63.5
SWO
  Top 0.305: U$3.P$6 48.77,73.15 50.38,73.15 R2.1
TXD  (via drill 0.35)
  Top 0.305: U$6.1 66.67,56.52 v66.04,55.88 | U1.62 48.05,67.86 48.77,68.58 48.77,69.34 v48.01,70.1
  Bottom 0.305: v66.04,55.88 63.63,58.29 53.34,58.29 48.01,63.63 v48.01,70.1
VBAT
  Bottom 1.016: U$8.1 87.35,32.15 C23.1 87.48,34.42 C22.1 84.51,41.07 | U$1.P$1 81.92,48.03 81.92,43.66 84.51,41.07 | U$2.P$1 89.44,41.07 84.51,41.07
VBATCELL1
  Top 0.305: R32.1 22.1,49.4 21.59,49.91 21.59,58.42 17.78,62.23 X1.1 TP5.1
VBATCELL2
  Top 0.305: TP6.1 X1.2 17.78,59.69 20.32,57.15 20.32,48.26 23.62,44.96 37.02,44.96 R33.1
VBATCELL3
  Top 0.305: R53.1 54.99,42.29 49.53,36.83 29.21,36.83 19.05,46.99 19.05,55.88 17.78,57.15 X1.3 TP7.1
VBATCELL4
  Top 0.305: TP8.1 X1.4
  Bottom 0.152: R44.2 35.88,69.98
  Bottom 0.305: 35.88,69.98 31.88,69.98 16.51,54.61 X1.4
VBATCELL5
  Top 0.305: TP9.1 X1.5
  Bottom 0.305: R36.2 31.75,64.77 19.05,52.07 X1.5
VBATCELL6
  Top 0.305: TP10.1 X1.6
  Bottom 0.305: R35.2 34.16,60.83 22.86,49.53 X1.6
VBATCELL7
  Top 0.305: TP11.1 X1.7
  Bottom 0.305: R34.2 30.1,50.42 26.67,46.99 X1.7
(copper drawn outside any net)
  shapes: Top area x2

### Text on the board
tPlace: GND | NRST | swo | NRST | SWDIO | GND | SWCLK | 3.3V | NC | Daniela Makowka | Fall 2022 Cornell Mars Rover | Voltage Monitoring Board | CANL Diode | ucontroller | Cell 1 | CANH Diode | GND | CANL | CAN Transceiver | Cell 2 | VBAT | CANH | Cell 3 | Cell 4 | Cell 5 | Cell 6 | 3.3V reg. | GND | Cell 7 | Red LED | CANL | GND | 3.3V test | VBAT | CANH | Vbat Decoupling | 5V test | 5V regulator | 3.3V LED | LED Curr. Limit. Res.